# Altium schematic sheet Connections.SchDoc
size B; SheetNumber: 2; SheetTotal: 3
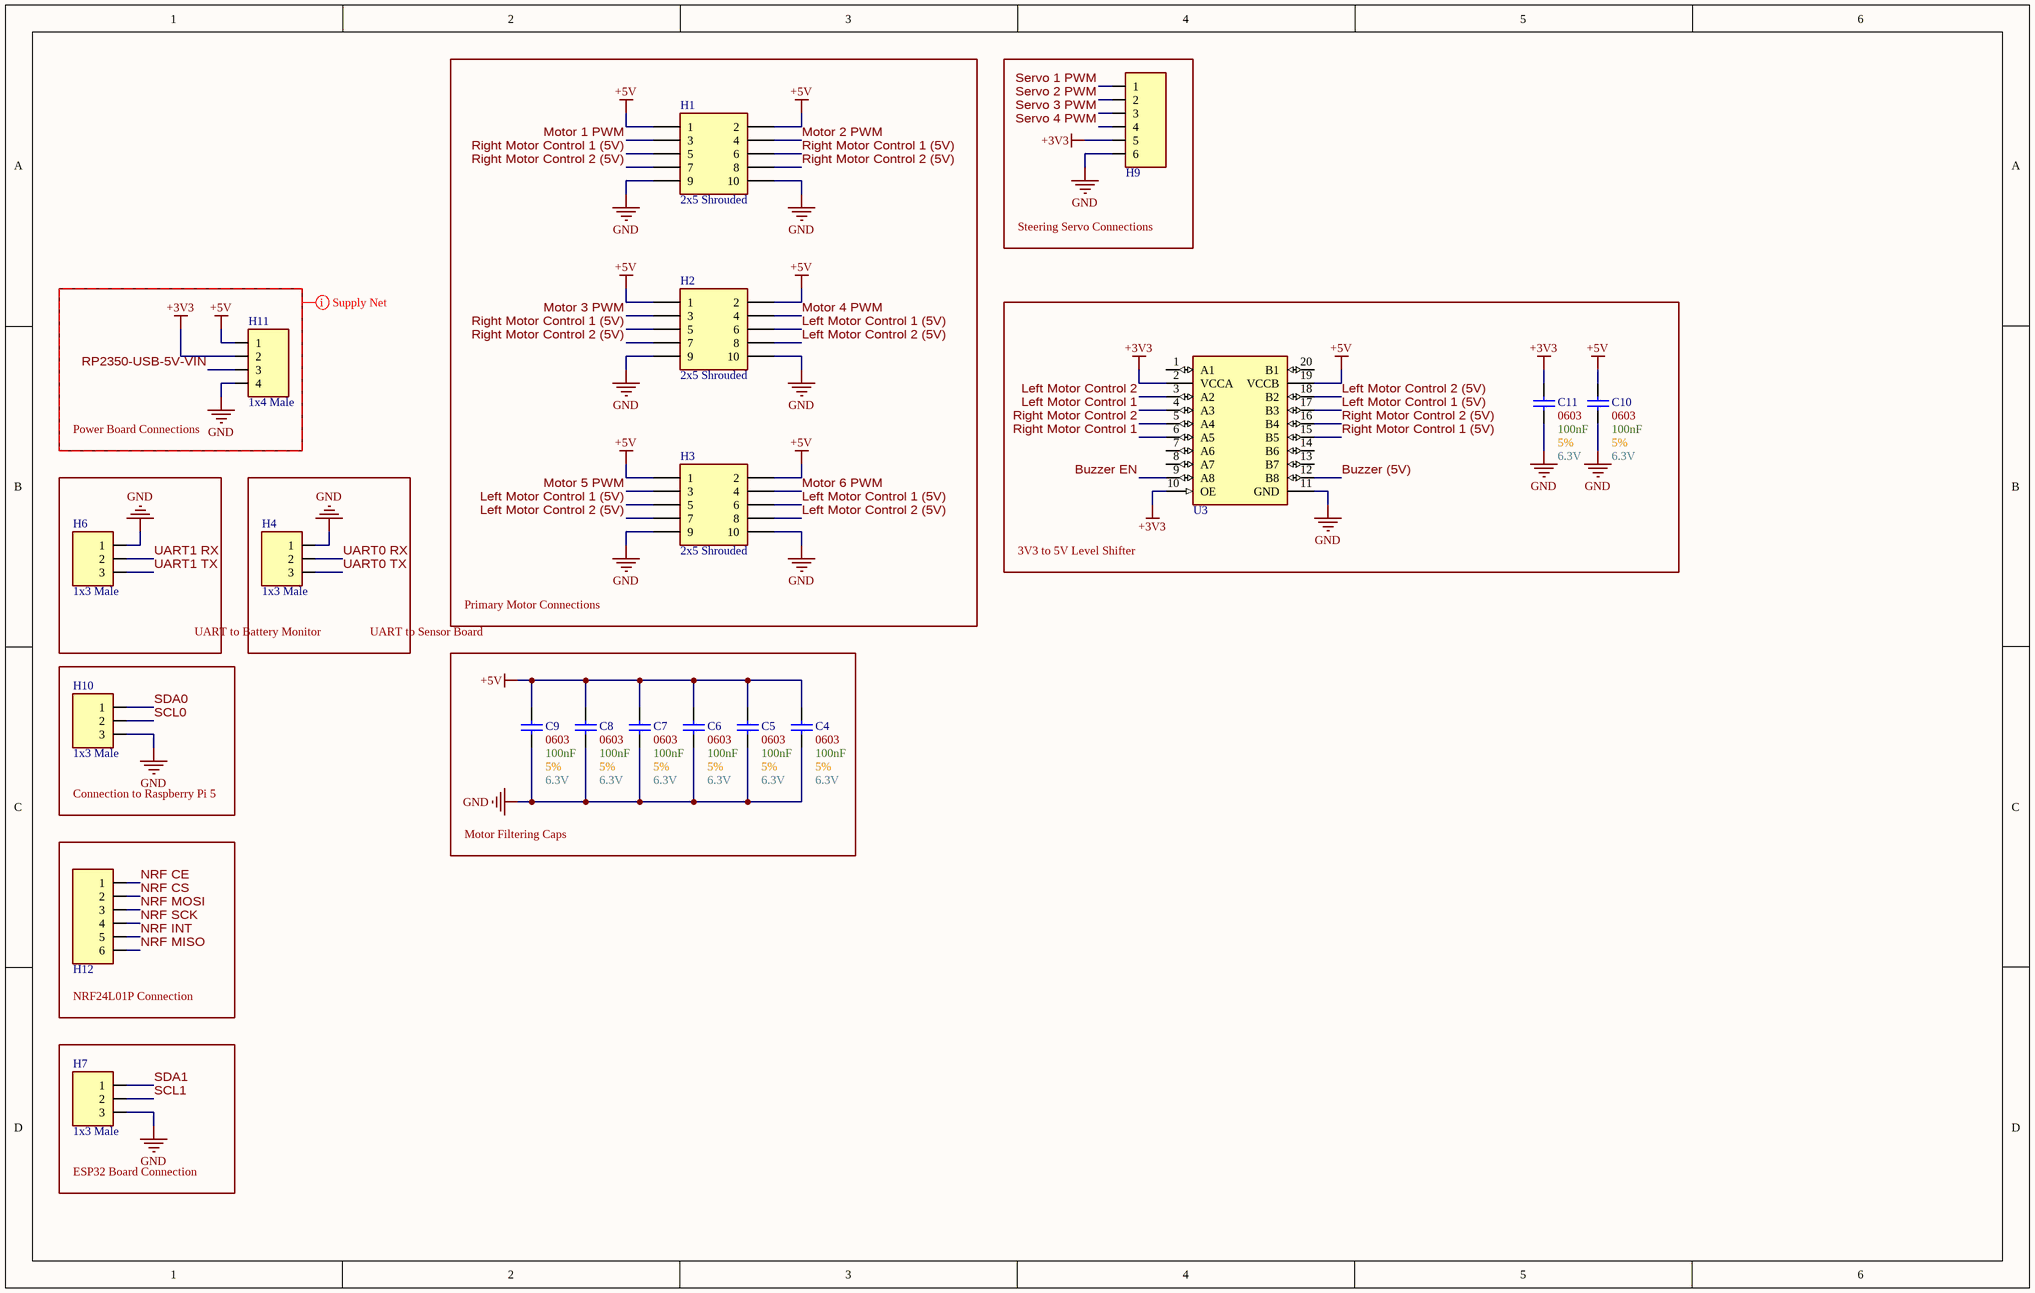
[diagram p0: Connections.SchDoc]

## Parts
C4  Size Package: 0603  Capacitance: 100nF  Voltage: 6.3V  Tolerance: 5%  [[Cap] SMD 0603]  (hidden comment: [Cap] SMD Nonpolarized)
C5  Size Package: 0603  Capacitance: 100nF  Voltage: 6.3V  Tolerance: 5%  [[Cap] SMD 0603]  (hidden comment: [Cap] SMD Nonpolarized)
C6  Size Package: 0603  Capacitance: 100nF  Voltage: 6.3V  Tolerance: 5%  [[Cap] SMD 0603]  (hidden comment: [Cap] SMD Nonpolarized)
C7  Size Package: 0603  Capacitance: 100nF  Voltage: 6.3V  Tolerance: 5%  [[Cap] SMD 0603]  (hidden comment: [Cap] SMD Nonpolarized)
C8  Size Package: 0603  Capacitance: 100nF  Voltage: 6.3V  Tolerance: 5%  [[Cap] SMD 0603]  (hidden comment: [Cap] SMD Nonpolarized)
C9  Size Package: 0603  Capacitance: 100nF  Voltage: 6.3V  Tolerance: 5%  [[Cap] SMD 0603]  (hidden comment: [Cap] SMD Nonpolarized)
C10  Size Package: 0603  Capacitance: 100nF  Voltage: 6.3V  Tolerance: 5%  [[Cap] SMD 0603]  (hidden comment: [Cap] SMD Nonpolarized)
C11  Size Package: 0603  Capacitance: 100nF  Voltage: 6.3V  Tolerance: 5%  [[Cap] SMD 0603]  (hidden comment: [Cap] SMD Nonpolarized)
H1  2x5 Shrouded  [[Header] Shrouded 2x5 Male]
H2  2x5 Shrouded  [[Header] Shrouded 2x5 Male]
H3  2x5 Shrouded  [[Header] Shrouded 2x5 Male]
H4  1x3 Male  [[Header] Shrouded 1x3 Male]
H6  1x3 Male  [[Header] Shrouded 1x3 Male]
H7  1x3 Male  [[Header] Shrouded 1x3 Male]
H9  [Header] Shrouded 1x6 Male  [[Header] Shrouded 1x6 Male]  (value not drawn)
H10  1x3 Male  [[Header] Shrouded 1x3 Male]
H11  1x4 Male  [[Header] Shrouded 1x4 Male]
H12  [Header] Shrouded 1x6 Male  [[Header] Shrouded 1x6 Male]  (value not drawn)
U3  [IC] Level Shifter (2)  [[IC] Level Shifter (2)]  (value not drawn)

## Blocks framed on the sheet
Primary Motor Connections: H1-H3
Steering Servo Connections: H9
Power Board Connections: H11
3V3 to 5V Level Shifter: C10 C11 U3
UART to Battery Monitor: H6
UART to Sensor Board: H4
Connection to Raspberry Pi 5: H10
Motor Filtering Caps: C4-C9
NRF24L01P Connection: H12
ESP32 Board Connection: H7

## Nets
+3V3: C11.2 H9.5 H11.2 U3.2(VCCA) U3.10(OE)
+5V: C4.2 C5.2 C6.2 C7.2 C8.2 C9.2 C10.2 H1.1 H1.2 H2.1 H2.2 H3.1 H3.2 H11.1 U3.19(VCCB)
GND: C4.1 C5.1 C6.1 C7.1 C8.1 C9.1 C10.1 C11.1 H1.9 H1.10 H2.9 H2.10 H3.9 H3.10 H4.1 H6.1 H7.3 H9.6 H10.3 H11.4 U3.11(GND)
Buzzer (5V): U3.12(B8)
Buzzer EN: U3.9(A8)
Left Motor Control 1: U3.4(A3)
Left Motor Control 1 (5V): H2.6 H3.5 H3.6 U3.17(B3)
Left Motor Control 2: U3.3(A2)
Left Motor Control 2 (5V): H2.8 H3.7 H3.8 U3.18(B2)
Motor 1 PWM: H1.3
Motor 2 PWM: H1.4
Motor 3 PWM: H2.3
Motor 4 PWM: H2.4
Motor 5 PWM: H3.3
Motor 6 PWM: H3.4
NRF CE: H12.1
NRF CS: H12.2
NRF INT: H12.5
NRF MISO: H12.6
NRF MOSI: H12.3
NRF SCK: H12.4
Right Motor Control 1: U3.6(A5)
Right Motor Control 1 (5V): H1.5 H1.6 H2.5 U3.15(B5)
Right Motor Control 2: U3.5(A4)
Right Motor Control 2 (5V): H1.7 H1.8 H2.7 U3.16(B4)
RP2350-USB-5V-VIN: H11.3
SCL0: H10.2
SCL1: H7.2
SDA0: H10.1
SDA1: H7.1
Servo 1 PWM: H9.1
Servo 2 PWM: H9.2
Servo 3 PWM: H9.3
Servo 4 PWM: H9.4
UART0 RX: H4.2
UART0 TX: H4.3
UART1 RX: H6.2
UART1 TX: H6.3

Not connected (* = marked no-connect by the designer): U3 1(A1) 7(A6) 8(A7) 13(B7) 14(B6) 20(B1)

## Layout directives
net class Supply_Nets: +3V3, +5V, GND, RP2350-USB-5V-VIN

## Library data of the parts
H1-H3 = [Header] Shrouded 2x5 Male: BHR-10-VUA; Supplier 1: DigiKey; Supplier Part Number 1: 2057-BHR-10-VUA-ND
H4 H6 H7 H10 = [Header] Shrouded 1x3 Male: 070543-0037 / Mates with 005057-9403; Supplier 1: DigiKey; Supplier Part Number 1: WM4825-ND
  H4 H7 H10: Supplier 2: DigiKey; Supplier Part Number 2: WM2901-ND
H9 H12 = [Header] Shrouded 1x6 Male: 0705430005 / Mates with 0050579406; Supplier 1: DigiKey; Supplier 2: DigiKey; Supplier Part Number 1: WM4804-ND; Supplier Part Number 2: WM2904-ND
H11 = [Header] Shrouded 1x4 Male: 70543-0003 / Mates with 005057-9404; Supplier 1: Avnet; Supplier Part Number 1: 0705430003
U3 = [IC] Level Shifter (2): TXS0108EQPWRQ1; Supplier 1: DigiKey; Supplier Part Number 1: 296-42401-1-ND
C4-C11 = [Cap] SMD Nonpolarized: Supplier 1: DigiKey; Supplier Part Number 1: 311-1088-6-ND